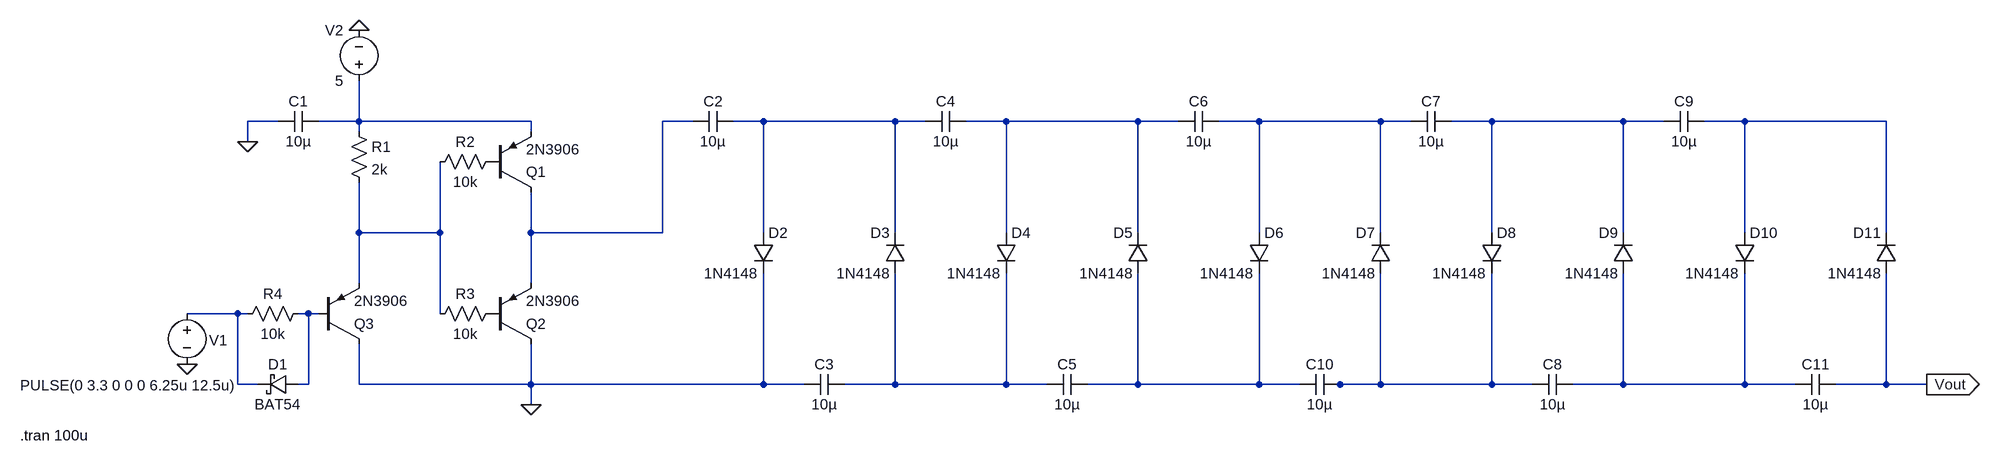
[diagram p0: schematic Charge Pump_NOT WORKING [VER 2].asc]
Charge Pump_NOT WORKING [VER 2].asc, the LTspice schematic file:
Version 4
SHEET 1 2832 680
WIRE 112 32 64 32
WIRE 240 32 240 -32
WIRE 240 32 176 32
WIRE 512 32 240 32
WIRE 768 32 720 32
WIRE 880 32 832 32
WIRE 1088 32 880 32
WIRE 1136 32 1088 32
WIRE 1264 32 1200 32
WIRE 1472 32 1264 32
WIRE 1536 32 1472 32
WIRE 1664 32 1600 32
WIRE 1856 32 1664 32
WIRE 1904 32 1856 32
WIRE 2032 32 1968 32
WIRE 2240 32 2032 32
WIRE 2304 32 2240 32
WIRE 2432 32 2368 32
WIRE 2656 32 2432 32
WIRE 240 48 240 32
WIRE 512 48 512 32
WIRE 64 64 64 32
WIRE 240 208 240 128
WIRE 368 208 368 96
WIRE 368 208 240 208
WIRE 512 208 512 144
WIRE 720 208 720 32
WIRE 720 208 512 208
WIRE 880 208 880 32
WIRE 1088 208 1088 32
WIRE 1264 208 1264 32
WIRE 1472 208 1472 32
WIRE 1664 208 1664 32
WIRE 1856 208 1856 32
WIRE 2032 208 2032 32
WIRE 2240 208 2240 32
WIRE 2432 208 2432 32
WIRE 2656 208 2656 32
WIRE 240 288 240 208
WIRE 512 288 512 208
WIRE 48 336 -32 336
WIRE 64 336 48 336
WIRE 160 336 144 336
WIRE 176 336 160 336
WIRE 368 336 368 208
WIRE 48 448 48 336
WIRE 80 448 48 448
WIRE 160 448 160 336
WIRE 160 448 144 448
WIRE 240 448 240 384
WIRE 512 448 512 384
WIRE 512 448 240 448
WIRE 880 448 880 272
WIRE 880 448 512 448
WIRE 944 448 880 448
WIRE 1088 448 1088 272
WIRE 1088 448 1008 448
WIRE 1264 448 1264 272
WIRE 1264 448 1088 448
WIRE 1328 448 1264 448
WIRE 1472 448 1472 272
WIRE 1472 448 1392 448
WIRE 1664 448 1664 272
WIRE 1664 448 1472 448
WIRE 1728 448 1664 448
WIRE 1792 448 1776 448
WIRE 1856 448 1856 272
WIRE 1856 448 1792 448
WIRE 2032 448 2032 272
WIRE 2032 448 1856 448
WIRE 2096 448 2032 448
WIRE 2240 448 2240 272
WIRE 2240 448 2160 448
WIRE 2432 448 2432 272
WIRE 2432 448 2240 448
WIRE 2512 448 2432 448
WIRE 2656 448 2656 272
WIRE 2656 448 2576 448
WIRE 2720 448 2656 448
WIRE 512 480 512 448
FLAG 64 64 0
FLAG -32 416 0
FLAG 512 480 0
FLAG 2720 448 Vout
IOPIN 2720 448 Out
FLAG 240 -112 0
SYMBOL cap 176 16 R90
WINDOW 0 0 32 VBottom 2
WINDOW 3 32 32 VTop 2
SYMATTR InstName C1
SYMATTR Value 10µ
SYMBOL res 224 32 R0
SYMATTR InstName R1
SYMATTR Value 2k
SYMBOL res 464 80 R90
WINDOW 0 0 56 VBottom 2
WINDOW 3 32 56 VTop 2
SYMATTR InstName R2
SYMATTR Value 10k
SYMBOL pnp 448 144 M180
SYMATTR InstName Q1
SYMATTR Value 2N3906
SYMBOL pnp 448 384 M180
SYMATTR InstName Q2
SYMATTR Value 2N3906
SYMBOL res 464 320 R90
WINDOW 0 0 56 VBottom 2
WINDOW 3 32 56 VTop 2
SYMATTR InstName R3
SYMATTR Value 10k
SYMBOL pnp 176 384 M180
SYMATTR InstName Q3
SYMATTR Value 2N3906
SYMBOL res 160 320 R90
WINDOW 0 0 56 VBottom 2
WINDOW 3 32 56 VTop 2
SYMATTR InstName R4
SYMATTR Value 10k
SYMBOL schottky 144 432 R90
WINDOW 0 0 32 VBottom 2
WINDOW 3 32 32 VTop 2
SYMATTR InstName D1
SYMATTR Value BAT54
SYMATTR Description Diode
SYMATTR Type diode
SYMBOL voltage -32 320 R0
WINDOW 0 35 58 Left 2
WINDOW 3 -264 129 Left 2
WINDOW 123 0 0 Left 0
WINDOW 39 0 0 Left 0
SYMATTR InstName V1
SYMATTR Value PULSE(0 3.3 0 0 0 6.25u 12.5u)
SYMBOL cap 832 16 R90
WINDOW 0 0 32 VBottom 2
WINDOW 3 32 32 VTop 2
SYMATTR InstName C2
SYMATTR Value 10µ
SYMBOL diode 864 208 R0
WINDOW 3 -78 64 Left 2
SYMATTR InstName D2
SYMATTR Value 1N4148
SYMBOL cap 1008 432 R90
WINDOW 0 0 32 VBottom 2
WINDOW 3 32 32 VTop 2
SYMATTR InstName C3
SYMATTR Value 10µ
SYMBOL diode 1104 272 R180
WINDOW 0 24 64 Left 2
WINDOW 3 24 0 Left 2
SYMATTR InstName D3
SYMATTR Value 1N4148
SYMBOL cap 1200 16 R90
WINDOW 0 0 32 VBottom 2
WINDOW 3 32 32 VTop 2
SYMATTR InstName C4
SYMATTR Value 10µ
SYMBOL diode 1248 208 R0
WINDOW 3 -78 64 Left 2
SYMATTR InstName D4
SYMATTR Value 1N4148
SYMBOL diode 1488 272 R180
WINDOW 0 24 64 Left 2
WINDOW 3 24 0 Left 2
SYMATTR InstName D5
SYMATTR Value 1N4148
SYMBOL diode 1648 208 R0
WINDOW 3 -78 64 Left 2
SYMATTR InstName D6
SYMATTR Value 1N4148
SYMBOL cap 1392 432 R90
WINDOW 0 0 32 VBottom 2
WINDOW 3 32 32 VTop 2
SYMATTR InstName C5
SYMATTR Value 10µ
SYMBOL cap 1600 16 R90
WINDOW 0 0 32 VBottom 2
WINDOW 3 32 32 VTop 2
SYMATTR InstName C6
SYMATTR Value 10µ
SYMBOL diode 1872 272 R180
WINDOW 0 24 64 Left 2
WINDOW 3 24 0 Left 2
SYMATTR InstName D7
SYMATTR Value 1N4148
SYMBOL cap 1968 16 R90
WINDOW 0 0 32 VBottom 2
WINDOW 3 32 32 VTop 2
SYMATTR InstName C7
SYMATTR Value 10µ
SYMBOL diode 2016 208 R0
WINDOW 3 -78 64 Left 2
SYMATTR InstName D8
SYMATTR Value 1N4148
SYMBOL diode 2256 272 R180
WINDOW 0 24 64 Left 2
WINDOW 3 24 0 Left 2
SYMATTR InstName D9
SYMATTR Value 1N4148
SYMBOL diode 2416 208 R0
WINDOW 3 -78 64 Left 2
SYMATTR InstName D10
SYMATTR Value 1N4148
SYMBOL cap 2160 432 R90
WINDOW 0 0 32 VBottom 2
WINDOW 3 32 32 VTop 2
SYMATTR InstName C8
SYMATTR Value 10µ
SYMBOL cap 2368 16 R90
WINDOW 0 0 32 VBottom 2
WINDOW 3 32 32 VTop 2
SYMATTR InstName C9
SYMATTR Value 10µ
SYMBOL cap 1792 432 R90
WINDOW 0 0 32 VBottom 2
WINDOW 3 32 32 VTop 2
SYMATTR InstName C10
SYMATTR Value 10µ
SYMBOL diode 2672 272 R180
WINDOW 0 24 64 Left 2
WINDOW 3 24 0 Left 2
SYMATTR InstName D11
SYMATTR Value 1N4148
SYMBOL cap 2576 432 R90
WINDOW 0 0 32 VBottom 2
WINDOW 3 32 32 VTop 2
SYMATTR InstName C11
SYMATTR Value 10µ
SYMBOL voltage 240 -16 R180
WINDOW 0 24 96 Left 2
WINDOW 3 24 16 Left 2
WINDOW 123 0 0 Left 0
WINDOW 39 0 0 Left 0
SYMATTR InstName V2
SYMATTR Value 5
TEXT -296 528 Left 2 !.tran 100u

The netlist it stands for:
* Charge Pump_NOT WORKING [VER 2].asc
C1 N001 0 10µ
R1 N001 N008 2k
R2 P001 N008 10k
Q1 N002 P001 N001 0 2N3906
Q2 0 P002 N002 0 2N3906
R3 P002 N008 10k
Q3 0 N010 N008 0 2N3906
R4 N010 N009 10k
D1 N010 N009 BAT54
V1 N009 0 PULSE(0 3.3 0 0 0 6.25u 12.5u)
C2 N003 N002 10µ
D2 N003 0 1N4148
C3 N011 0 10µ
D3 N011 N003 1N4148
C4 N004 N003 10µ
D4 N004 N011 1N4148
D5 N012 N004 1N4148
D6 N005 N012 1N4148
C5 N012 N011 10µ
C6 N005 N004 10µ
D7 N013 N005 1N4148
C7 N006 N005 10µ
D8 N006 N013 1N4148
D9 N014 N006 1N4148
D10 N007 N014 1N4148
C8 N014 N013 10µ
C9 N007 N006 10µ
C10 N013 N012 10µ
D11 Vout N007 1N4148
C11 Vout N014 10µ
V2 N001 0 5
.model D D
.lib standard.dio
.model NPN NPN
.model PNP PNP
.lib standard.bjt
.tran 100u
.backanno
.end